# Altium schematic sheet Power.SchDoc: Power
size A3; DrawnBy: Mogens Groth Nicolaisen; DocumentNumber: 5; SheetNumber: 5; SheetTotal: 7
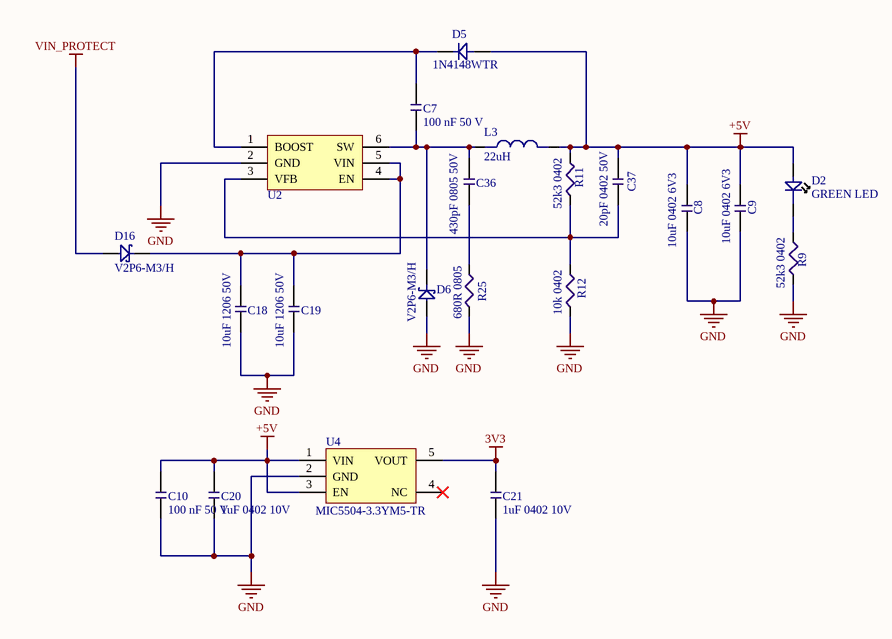
[diagram p0: Power.SchDoc]

## Parts
C7  100 nF 50 V  [CAP_0402]
C8  10uF 0402 6V3  [CAP_0402]
C9  10uF 0402 6V3  [CAP_0402]
C10  100 nF 50 V  [CAP_0402]
C18  10uF 1206 50V  [CAP_1206]
C19  10uF 1206 50V  [CAP_1206]
C20  1uF 0402 10V  [CAP_0402]
C21  1uF 0402 10V  [CAP_0402]
C36  430pF 0805 50V  [CAP_0805]
C37  20pF 0402 50V  [CAP_0402]
D2  GREEN LED  [0402 LED]
D5  1N4148WTR  [SODFL371X135-2N]
D6  V2P6-M3/H  [MicroSMP]
D16  V2P6-M3/H  [MicroSMP]
L3  22uH  [NR6028T220M]
R9  52k3 0402  [RES_0402]
R11  52k3 0402  [RES_0402]
R12  10k 0402  [RES_0402]
R25  680R 0805  [RES_0805]
U2  MCP16331  [SOT95P280X145-6N]  (value not drawn)
U4  MIC5504-3.3YM5-TR  [SOT95P280X130-5N]

## Nets
3V3: C21.2 U4.5(VOUT)
+5V: C8.2 C9.2 C10.1 C20.2 C37.1 D2.1 D5.1 L3.2 R11.2 U4.1(VIN) U4.3(EN)
GND: C8.1 C9.1 C10.2 C18.1 C19.1 C20.1 C21.1 D6.1 R9.1 R12.1 R25.1 U2.2(GND) U4.2(GND)
VIN_PROTECT: D16.1
NetC7_1: C7.1 D5.2 U2.1(BOOST)
NetC7_2: C7.2 C36.1 D6.2 L3.1 U2.6(SW)
NetC18_2: C18.2 C19.2 D16.2 U2.4(EN) U2.5(VIN)
NetC36_2: C36.2 R25.2
NetC37_2: C37.2 R11.1 R12.2 U2.3(VFB)
NetD2_2: D2.2 R9.2

Not connected (* = marked no-connect by the designer): U4 4(NC)*

## Notes on the sheet
- ON Development
- Title:
- Size:
- A3
- Drawn By:
- Date:
- Sheet
- of
- Revision:

## Library data of the parts
C7 C10 = CMP-00088-2: Multilayer Ceramic Capacitors MLCC - SMD/SMT .1uF 50Volts X7R +/-10% 0402 STD; Tolerance: 10%; Value: 100nF; Voltage: 50 V; Voltage Rating (DC): 50V; Capacitance: 100nF; Case/Package: 0402; Case Code (Imperial): 0402; Case Code (Metric): 1005; Dielectric: X7R; Halogen Free: Halogen Free; Height: 0.5mm; Lead Free: Lead Free; Length: 0.039inch; Max Operating Temperature: 125°C; Min Operating Temperature: -55°C; Mount: Surface Mount; Package Quantity: 10000; Packaging: Tape and Reel; Termination: SMD/SMT; Thickness: 0.022inch; Voltage Rating: 50V; Width: 0.5mm
C8 C9 = CMP-00011-3: 10uF 20% 0402 6V3 X6S; Current Rating: -; Tolerance: 20%; Value: 10uF; Voltage: 6V3
C18 C19 = CMP-00030-4: 10uF 1206 50V X5R 20%; Tolerance: +/- 20%; Value: 10uF; Voltage: 50 V
C20 C21 = CMP-00032-5: 1uF 0402 10V 10% X5R; Material: Ceramic; Tolerance: 10%; Value: 1 uF; Voltage: 10 V; Capacitance: 1uF; Case/Package: 0402; Case Code (Imperial): 0402; Case Code (Metric): 1005; Contact Plating: Tin; Depth: 0.5mm; Dielectric: X5R; Height: 0.5mm; Length: 1mm; Max Operating Temperature: 85°C; Min Operating Temperature: -55°C; Mount: Surface Mount; Package Quantity: 1; Packaging: Tape and Reel; Radiation Hardening: No; Thickness: 0.022inch; Voltage Rating: 10V; Width: 0.02inch
C36 = CMP-00058-4: CAP CER 430PF 50V C0G/NP0 0805; Mfg. Part Number: CL21C431JBANNNC; Tolerance: 5%; Value: 430pF; Voltage: 50V
C37 = CMP-00049-4: 20pF 0402 50V C0G 5%; Mfg. Part Number: GRM1555C1H200JA01D; Tolerance: 5%; Value: 20pF; Voltage: 50 V
D2 = CMP-008-0001-2: 0402 SMD LED; Mfg. Part Number: LTST-C281KGKT
D5 = CMP-016-0003-2: DIODE GEN PURP 75V 250MA SOD123
D6 D16 = CMP-016-0002-2: DIODE SCHOTTKY 60V 2A MICROSMP
L3 = CMP-007-0002-3: FIXED IND 22UH 1.4A 175.5 MOHM; FootprintName1: NR6028T220M; FootprintRevisionID1: PCC-0032-1; Value: 22 uH; Case/Package: -; Current: 1.4 A; Mfg. Part Number: NR6028T220M
R9 R11 = CMP-001-0018-3: RES SMD 52.3K OHM 1% 1/16W 0402; Mfg. Part Number: RC0402FR-0752K3L; Case/Package: 0402; Power: 1/16 W; Tolerance: 1 %; Value: 52k3
R12 = CMP-001-0019-3: RES SMD 10K OHM 1% 1/16W 0402; Mfg. Part Number: RMCF0402FT10K0; Case/Package: 0402; Power: 1/16 W; Tolerance: 1 %; Value: 10k
R25 = CMP-001-0036-3: RES SMD 680 OHM 1% 1/8W 0805; Mfg. Part Number: RC0805FR-07680RL; Case/Package: 0805; Power: 1/8W; Tolerance: 1%; Value: 680R
U2 = CMP-00029-4: High-Voltage Input Integrated Switch Step-Down Regulator
U4 = CMP-00031-4: LDO Voltage Regulators Single 300mA